# EAGLE design board_rev_1 (EAGLE 5.11)
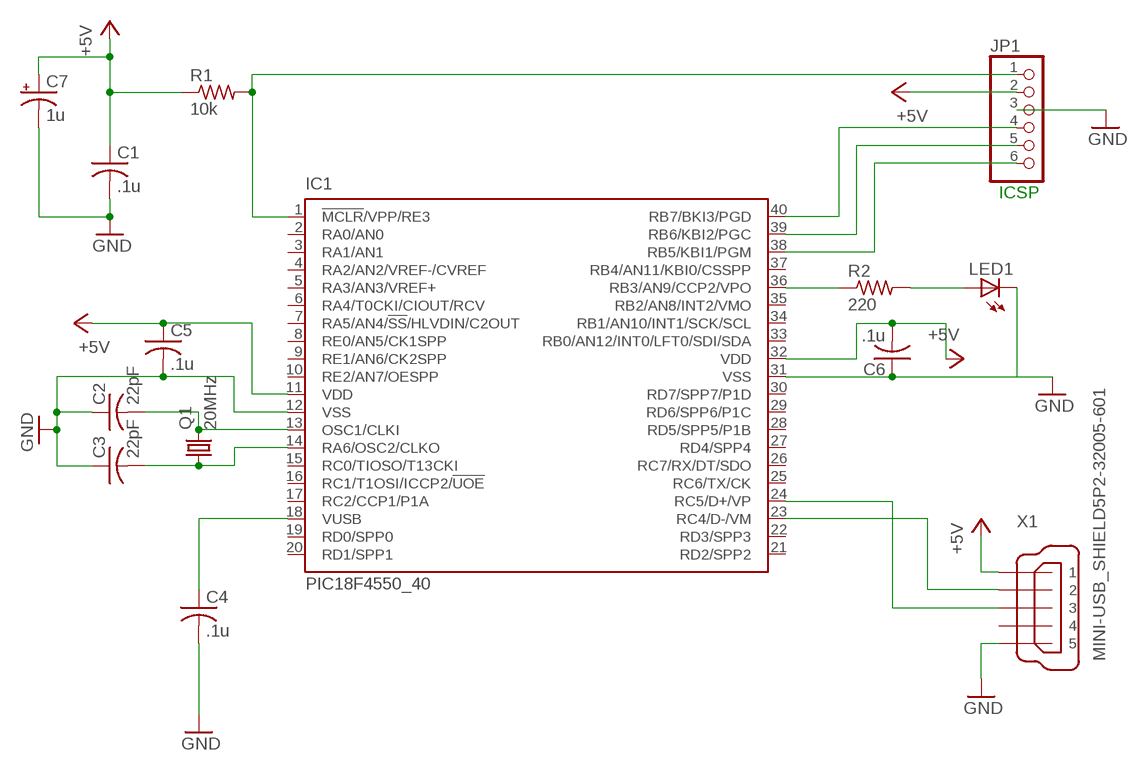
[diagram p0: schematic, sheet 1]

## Parts
C1  .1u  C-US025-030X050  [C025-030X050]
C2  22pF  C-US025-030X050  [C025-030X050]
C3  22pF  C-US025-030X050  [C025-030X050]
C4  .1u  C-US025-030X050  [C025-030X050]
C5  .1u  C-US025-030X050  [C025-030X050]
C6  .1u  C-US025-030X050  [C025-030X050]
C7  1u  CPOL-USE2,5-6E  [E2,5-6E]
IC1  PIC18F4550_40  [DIL40]
JP1  PINHD-1X6  [1X06]
LED1  LED5MM  [LED5MM]
Q1  20MHz  CRYSTALHC49S  [HC49/S]
R1  10k  R-US_0207/10  [0207/10]
R2  220  R-US_0204/7  [0204/7]
X1  MINI-USB_SHIELD5P2-32005-601  [32005-601]

## Nets
+5V: C1.1 C5.1 C6.2 C7.+ IC1.11(VDD) IC1.32(VDD) JP1.2 R1.1 X1.1
GND: C1.2 C2.1 C3.1 C4.2 C5.2 C6.1 C7.- IC1.12(VSS) IC1.31(VSS) JP1.3 LED1.K(C) X1.5
N$1: IC1.1(!MCLR!/VPP/RE3) JP1.1 R1.2
N$3: IC1.40(RB7/BKI3/PGD) JP1.4
N$4: IC1.39(RB6/KBI2/PGC) JP1.5
N$5: IC1.38(RB5/KBI1/PGM) JP1.6
N$6: IC1.23(RC4/D-/VM) X1.2
N$7: IC1.24(RC5/D+/VP) X1.3
N$8: C2.2 IC1.13(OSC1/CLKI) Q1.2
N$9: C3.2 IC1.14(RA6/OSC2/CLKO) Q1.1
N$11: C4.1 IC1.18(VUSB)
N$12: IC1.36(RB3/AN9/CCP2/VPO) R2.1
N$13: LED1.A R2.2
Unconnected: IC1.2(RA0/AN0) IC1.3(RA1/AN1) IC1.4(RA2/AN2/VREF-/CVREF) IC1.5(RA3/AN3/VREF+) IC1.6(RA4/T0CKI/CIOUT/RCV) IC1.7(RA5/AN4/!SS!/HLVDIN/C2OUT) IC1.8(RE0/AN5/CK1SPP) IC1.9(RE1/AN6/CK2SPP) IC1.10(RE2/AN7/OESPP) IC1.15(RC0/TIOSO/T13CKI) IC1.16(RC1/T1OSI/ICCP2/!UOE) IC1.17(RC2/CCP1/P1A) IC1.19(RD0/SPP0) IC1.20(RD1/SPP1) IC1.21(RD2/SPP2) IC1.22(RD3/SPP3) IC1.25(RC6/TX/CK) IC1.26(RC7/RX/DT/SDO) IC1.27(RD4/SPP4) IC1.28(RD5/SPP5/P1B) IC1.29(RD6/SPP6/P1C) IC1.30(RD7/SPP7/P1D) IC1.33(RB0/AN12/INT0/LFT0/SDI/SDA) IC1.34(RB1/AN10/INT1/SCK/SCL) IC1.35(RB2/AN8/INT2/VMO) IC1.37(RB4/AN11/KBI0/CSSPP) X1.4 X1.M1(S1) X1.M2(S2)

## Notes on the sheet
- ICSP

## Library data of the parts
C1-C6 = rcl:C-US: CAPACITOR, American symbol
C7 = rcl:CPOL-US: POLARIZED CAPACITOR, American symbol
IC1 = microchip:PIC18F4*_40: USB Microcontrollers with nanoWatt Technology High-Performance, Enhanced Flash, 28/40/44-Pin, Source: http://ww1.microchip.com/downloads/en/devicedoc/39632c.pdf; MF: MICROCHIP; MPN: PIC18F4550-I/P; OC_FARNELL: 9321357; OC_NEWARK: 74K8623
JP1 = pinhead:PINHD-1X6: PIN HEADER
LED1 = led:LED: LED OSRAM: - CHIPLED LG R971, LG N971, LY N971, LG Q971, LY Q971, LO R971, LY R971 LH N974, LH R974 LS Q976, LO Q976, LY Q976 LO Q996 - Hyper CHIPLED LW Q18S LB Q993, LB Q99A, LB R99A - SideLED LS A670, LO A670, LY A670, LG A670, LP A670 LB A673, LV A673, LT A673, LW A673 LH A674 LY A675 LS A676, LA A676, LO A676, LY A676, LW A676 LS A679, LY A679, LG A679 - Hyper Micro SIDELED® LS Y876, LA Y876, LO Y876, LY Y876 LT Y87S - SmartLED LW L88C, LW L88S LB L89C, LB L89S, LG L890 LS L89K, LO L89K, LY L89K LS L896, LA L896, LO L896, LY L896 - TOPLED LS T670, LO T670, LY T670, LG T670, LP T670 LSG T670, LSP T670, LSY T670, LOP T670, LYG T670 LG T671, LOG T671, LSG T671 LB T673, LV T673, LT T673, LW T673 LH T674 LS T676, LA T676, LO T676, LY T676, LB T676, LH T676, LSB T676, LW T676 LB T67C, LV T67C, LT T67C, LS T67K, LO T67K, LY T67K, LW E67C LS E67B, LA E67B, LO E67B, LY E67B, LB E67C, LV E67C, LT E67C LW T67C LS T679, LY T679, LG T679 LS T770, LO T770, LY T770, LG T770, LP T770 LB T773, LV T773, LT T773, LW T773 LH T774 LS E675, LA E675, LY E675, LS T675 LS T776, LA T776, LO T776, LY T776, LB T776 LHGB T686 LT T68C, LB T68C - Hyper Mini TOPLED® LB M676 - Mini TOPLED Santana® LG M470 LS M47K, LO M47K, LY M47K Source: http://www.osram.convergy.de LUXEON: - LUMILED® LXK2-PW12-R00, LXK2-PW12-S00, LXK2-PW14-U00, LXK2-PW14-V00 LXK2-PM12-R00, LXK2-PM12-S00, LXK2-PM14-U00 LXK2-PE12-Q00, LXK2-PE12-R00, LXK2-PE12-S00, LXK2-PE14-T00, LXK2-PE14-U00 LXK2-PB12-K00, LXK2-PB12-L00, LXK2-PB12-M00, LXK2-PB14-N00, LXK2-PB14-P00, LXK2-PB14-Q00 LXK2-PR12-L00, LXK2-PR12-M00, LXK2-PR14-Q00, LXK2-PR14-R00 LXK2-PD12-Q00, LXK2-PD12-R00, LXK2-PD12-S00 LXK2-PH12-R00, LXK2-PH12-S00 LXK2-PL12-P00, LXK2-PL12-Q00, LXK2-PL12-R00 Source: www.luxeon.com KINGBRIGHT: KA-3528ASYC Source: www.kingbright.com
Q1 = crystal:CRYSTAL: CRYSTAL; OC_FARNELL: 1667008; OC_NEWARK: unknown
R1 R2 = rcl:R-US_: RESISTOR, American symbol
X1 = con-cypressindustries:MINI-USB_SHIELD5P2-: MINI USB-B R/A DIP 5pol. Source: www.cypressindustries.com; OC_FARNELL: unknown; OC_NEWARK: unknown

## Board
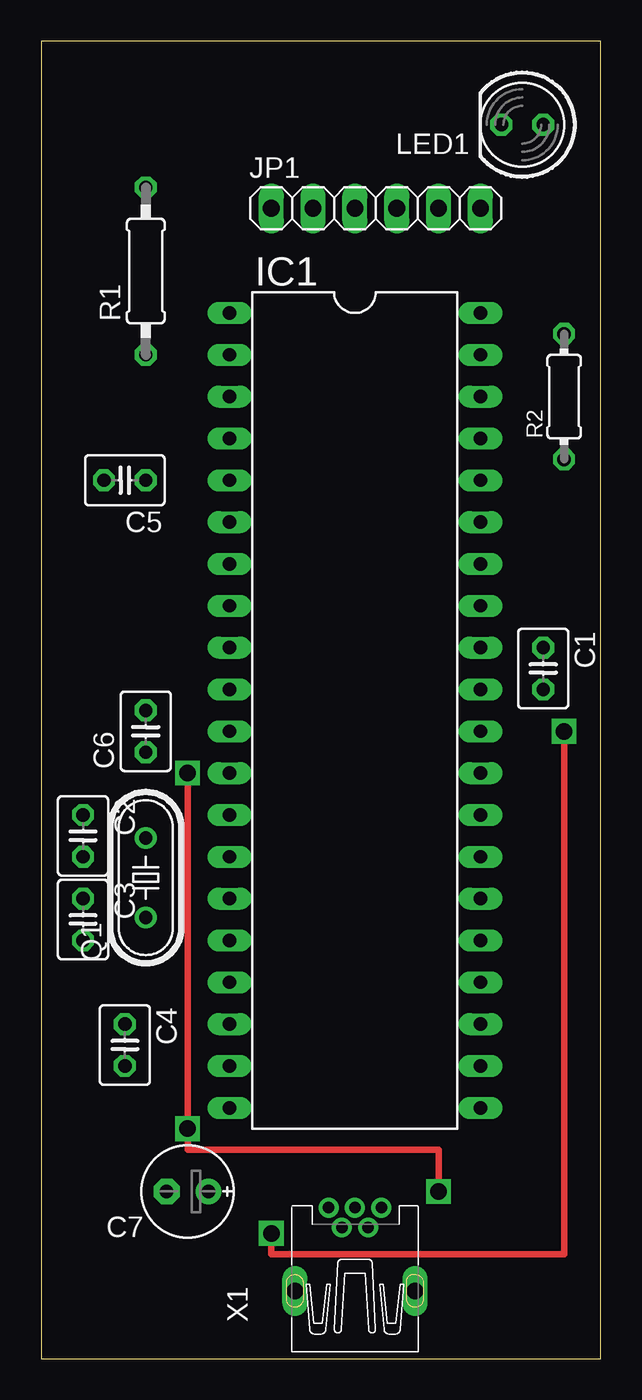
[diagram p1: board, top side]
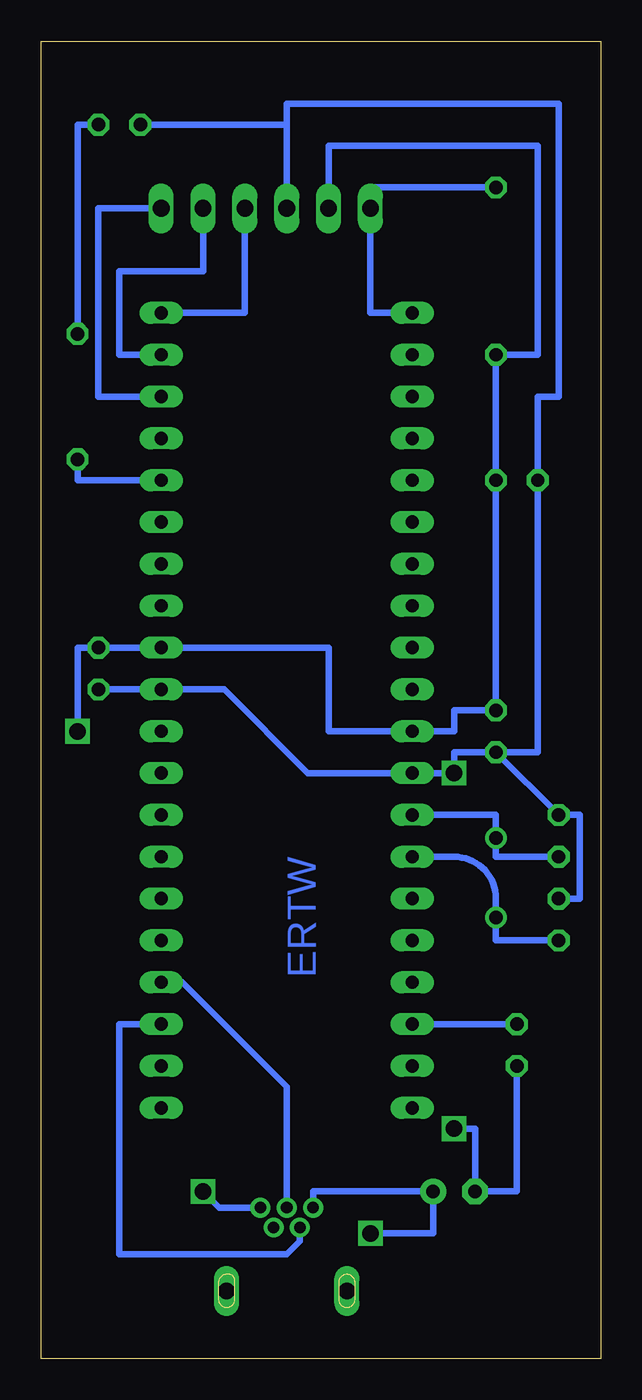
[diagram p2: board, bottom side, seen from below]

Size 33.96 x 80 mm. Coordinates in mm from the lower left corner, seen from the top.
Outline: 0,0 33.96,0 33.96,80 0,80 0,0
Copper layers (1*16): Top 0.035mm / dielectric 1.5mm / Bottom 0.035mm
Design rules "default": minimum track width 10mil, minimum drill 24mil, track to track 8mil, track to pad 8mil, pad to pad 8mil, via to via 8mil, smd to smd 8mil, copper to edge 40mil, drill to drill 8mil, minimum pad ring 10mil, minimum via ring 8mil, stop-mask expansion 4mil, vias tented up to drill 0mil, thermal gap 10mil

### Footprints (pad centres in the part's own frame; a part is rotated, then mirrored left to right if it is on the bottom)
C025-030X050 = drill 0.813 octagon: 1 -1.27,0; 2 1.27,0
E2,5-6E = drill 0.813 pad 1.575 round: + -1.27,0 | drill 0.813 pad 1.575 octagon: - 1.27,0
DIL40 = drill 0.813 long: 1 -24.13,-7.62; 2 -21.59,-7.62; 3 -19.05,-7.62; 4 -16.51,-7.62; 5 -13.97,-7.62; 6 -11.43,-7.62; 7 -8.89,-7.62; 8 -6.35,-7.62; 9 -3.81,-7.62; 10 -1.27,-7.62; 11 1.27,-7.62; 12 3.81,-7.62; 13 6.35,-7.62; 14 8.89,-7.62; 15 11.43,-7.62; 16 13.97,-7.62; 17 16.51,-7.62; 18 19.05,-7.62; 19 21.59,-7.62; 20 24.13,-7.62; 21 24.13,7.62; 22 21.59,7.62; 23 19.05,7.62; 24 16.51,7.62; 25 13.97,7.62; 26 11.43,7.62; 27 8.89,7.62; 28 6.35,7.62; 29 3.81,7.62; 30 1.27,7.62; 31 -1.27,7.62; 32 -3.81,7.62; 33 -6.35,7.62; 34 -8.89,7.62; 35 -11.43,7.62; 36 -13.97,7.62; 37 -16.51,7.62; 38 -19.05,7.62; 39 -21.59,7.62; 40 -24.13,7.62
1X06 = drill 1.016 long: 1 -6.35,0; 2 -3.81,0; 3 -1.27,0; 4 1.27,0; 5 3.81,0; 6 6.35,0
LED5MM = drill 0.813 octagon: A -1.27,0; K 1.27,0
HC49/S = drill 0.813 round: 1 -2.413,0; 2 2.413,0
0207/10 = drill 0.813 octagon: 1 -5.08,0; 2 5.08,0
0204/7 = drill 0.813 octagon: 1 -3.81,0; 2 3.81,0
32005-601 = drill 0.7 pad 1.016 round: 1 2.825,1.6; 2 1.625,0.8; 3 2.825,0; 4 1.625,-0.8; 5 2.825,-1.6 | drill 1 pad 1.422 long: M1 -2.225,3.65; M2 -2.225,-3.65

### Placement (x,y rotation side)
C1  30.48,41.91 270 top
C2  2.54,31.75 270 top
C3  2.54,26.67 270 top
C4  5.08,19.05 270 top
C5  5.08,53.34 180 top
C6  6.35,38.1 90 top
C7  8.89,10.16 180 top
IC1  19.05,39.37 270 top
JP1  20.32,69.85 0 top
LED1  29.21,74.93 180 top
Q1  6.35,29.21 90 top
R1  6.35,66.04 90 top
R2  31.75,58.42 90 top
X1  19.05,6.35 90 top

### Tracks (layer width: path | path; a pad name or v marks a point on that pad's centre or on a via)
+5V  (via drill 1 pad 1.27)
  Top 0.406: v13.97,7.62 13.97,6.35 31.75,6.35 v31.75,38.1
  Bottom 0.406: X1.1 17.45,10.16 C7.+ 10.16,7.62 v13.97,7.62 | JP1.2 16.51,73.66 3.81,73.66 3.81,60.96 R1.1 C5.1 C6.2 8.89,39.37 8.89,38.1 IC1.11 16.51,38.1 16.51,43.18 IC1.32 C1.1 31.75,43.18 v31.75,38.1
GND  (via drill 1 pad 1.27)
  Top 0.406: v24.13,10.16 24.13,12.7 8.89,12.7 v8.89,13.97 v8.89,35.56
  Bottom 0.406: C1.2 IC1.31 22.86,40.64 17.78,35.56 IC1.12 v8.89,35.56 8.89,36.83 C6.1 | C6.1 C2.1 1.27,33.02 1.27,27.94 C3.1 | X1.5 23.14,9.18 v24.13,10.16 | C4.2 5.08,10.16 C7.- 7.62,13.97 v8.89,13.97 | 19.05,74.93 JP1.3 | 19.05,74.93 LED1.K | 19.05,74.93 19.05,76.2 2.54,76.2 2.54,58.42 3.81,58.42 C5.2 3.81,36.83 C6.1
N$1
  Bottom 0.406: R1.2 13.97,71.12 JP1.1 13.97,63.5 IC1.1
N$3
  Bottom 0.406: JP1.4 21.59,63.5 IC1.40
N$4
  Bottom 0.406: JP1.5 24.13,66.04 29.21,66.04 29.21,60.96 IC1.39
N$5
  Bottom 0.406: IC1.38 30.48,58.42 30.48,69.85 JP1.6
N$6
  Bottom 0.406: X1.2 18.25,7.15 19.05,6.35 29.21,6.35 29.21,20.32 IC1.23
N$7
  Bottom 0.406: IC1.24 25.4,22.86 19.05,16.51 X1.3
N$8
  Bottom 0.406: C2.2 6.35,30.48 Q1.2 6.35,33.02 IC1.13
N$9
  Bottom 0.406: IC1.14 8.89,30.48 arc90 6.35,27.94 Q1.1 6.35,25.4 C3.2
N$11
  Bottom 0.406: C4.1 IC1.18
N$12
  Bottom 0.406: IC1.36 31.75,53.34 R2.1
N$13
  Bottom 0.406: R2.2 31.75,74.93 LED1.A

### Text on the board
Bottom: ERTW